# Altium schematic sheet peripherals.SchDoc
size A3
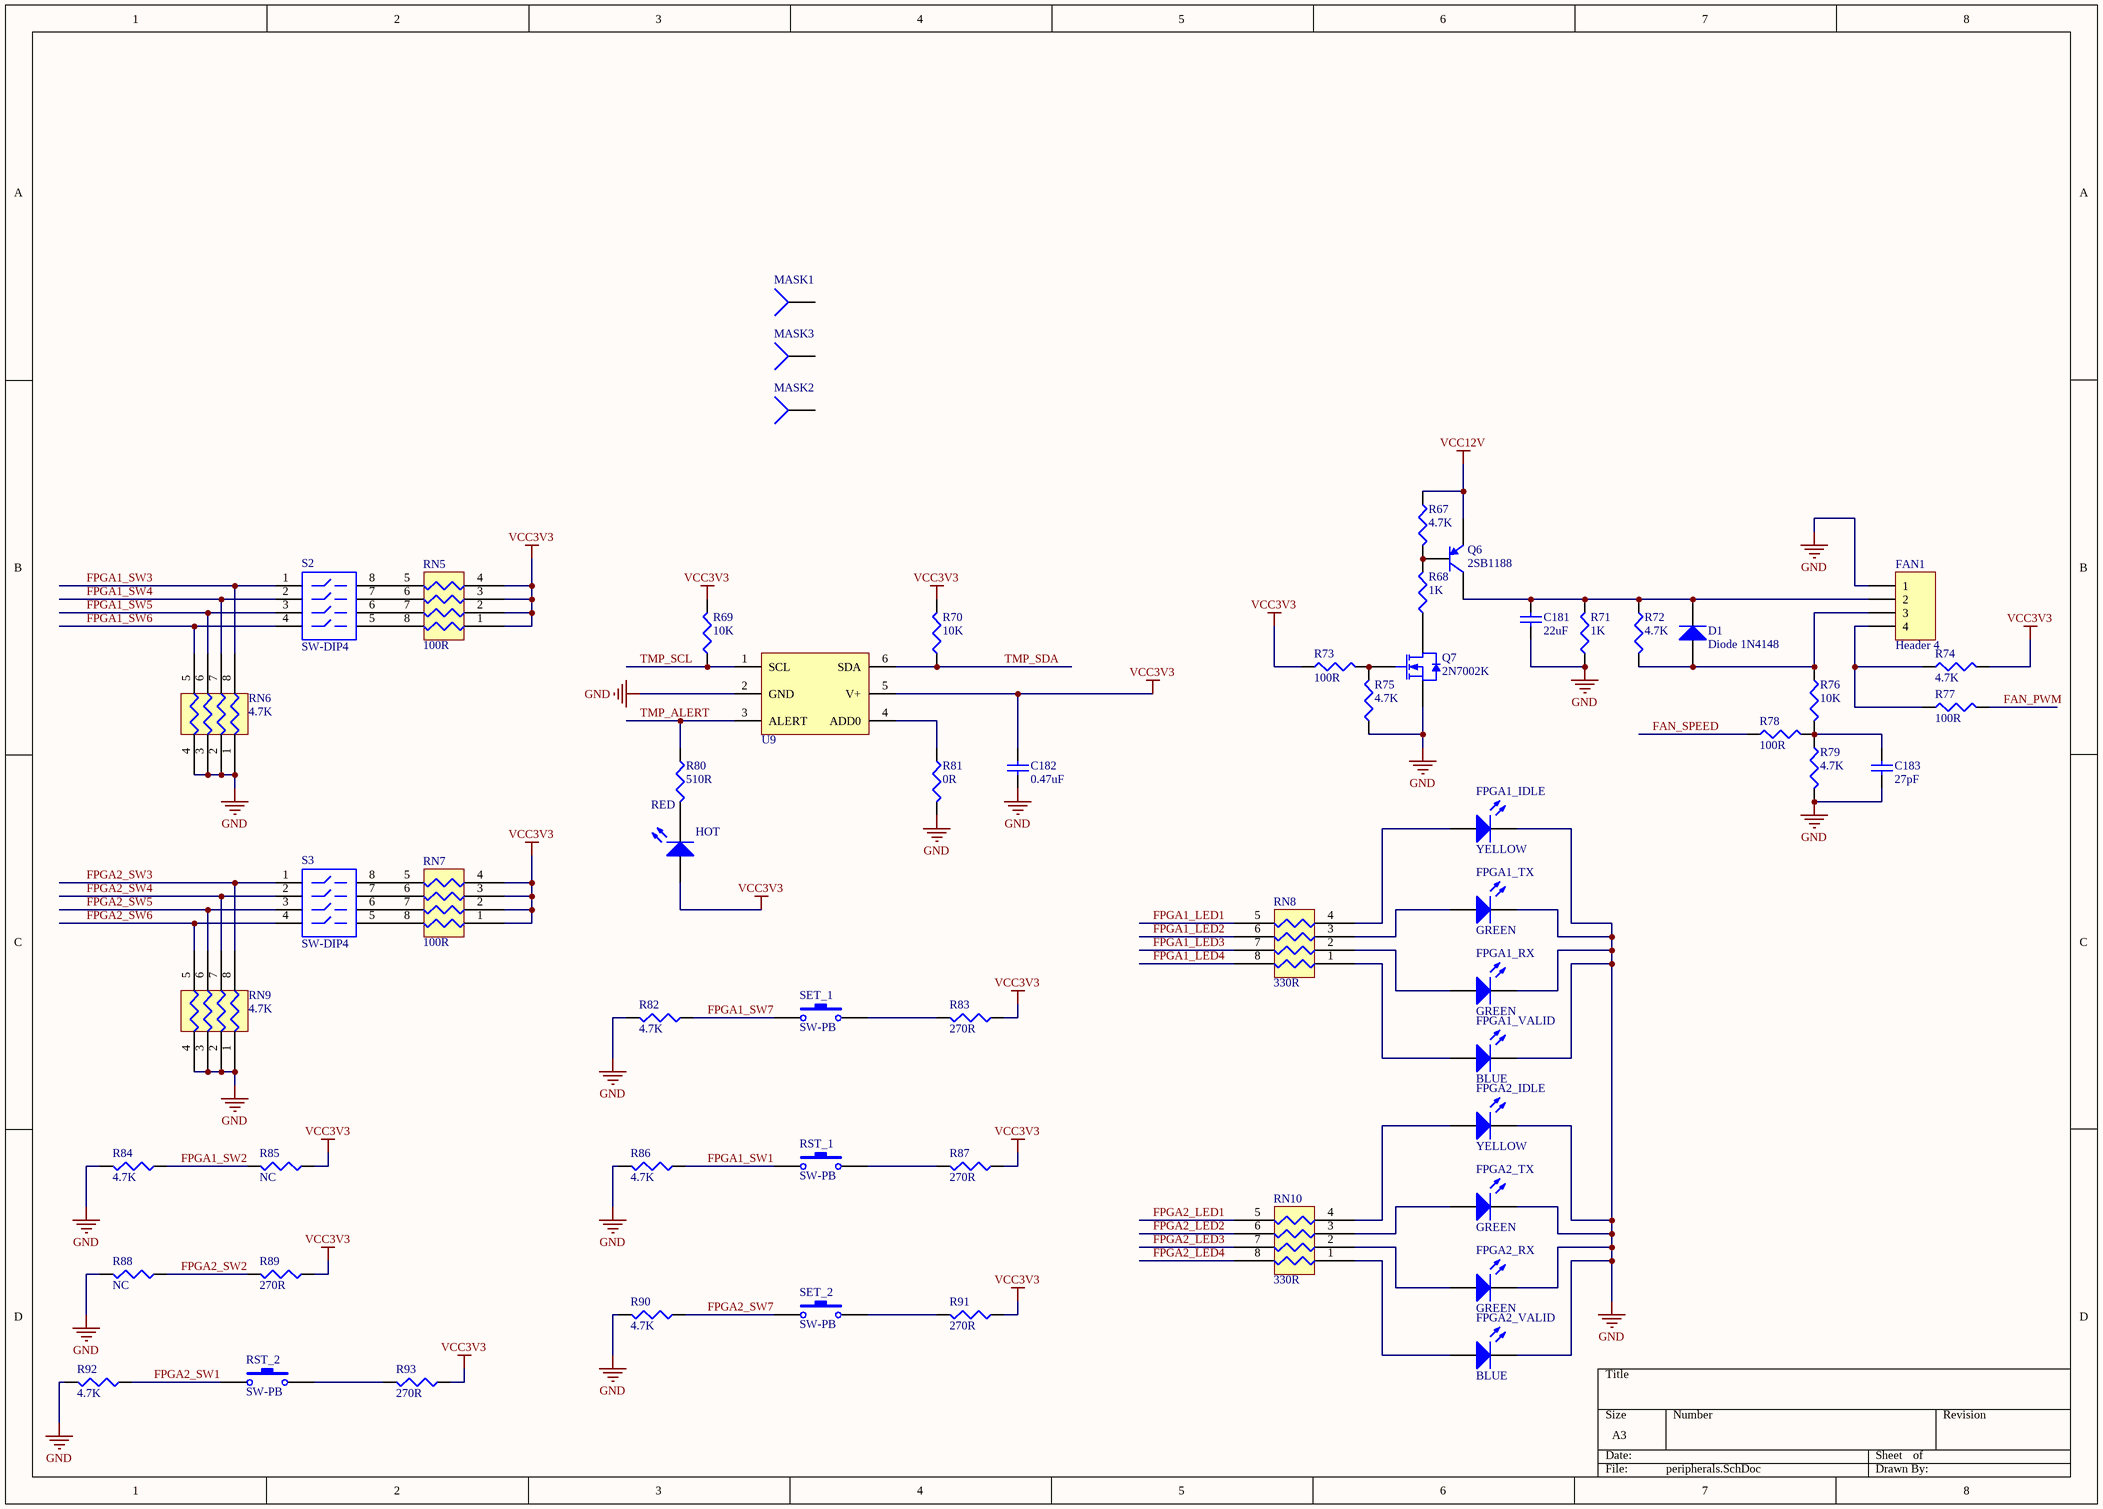
[diagram p0: peripherals.SchDoc]

## Parts
C181  22uF  [CAPC3225N]
C182  0.47uF  [CAPC1005N]
C183  27pF  [CAPC1005N]
D1  Diode 1N4148  [CD3216-1206]
FAN1  Header 4  [4PINFAN]
FPGA1_IDLE  YELLOW  [CD1608-0603]
FPGA1_RX  GREEN  [CD1608-0603]
FPGA1_TX  GREEN  [CD1608-0603]
FPGA1_VALID  BLUE  [CD1608-0603]
FPGA2_IDLE  YELLOW  [CD1608-0603]
FPGA2_RX  GREEN  [CD1608-0603]
FPGA2_TX  GREEN  [CD1608-0603]
FPGA2_VALID  BLUE  [CD1608-0603]
HOT  RED  [CD1608-0603]
MASK1  Socket  [MASK]  (value not drawn)
MASK2  Socket  [MASK]  (value not drawn)
MASK3  Socket  [MASK]  (value not drawn)
Q6  2SB1188  [SOT89M]
Q7  2N7002K  [SOT23_N]
R67  4.7K  [RESC1005N]
R68  1K  [RESC1005N]
R69  10K  [RESC1005N]
R70  10K  [RESC1005N]
R71  1K  [RESC1005N]
R72  4.7K  [RESC1005N]
R73  100R  [RESC1005N]
R74  4.7K  [RESC1005N]
R75  4.7K  [RESC1005N]
R76  10K  [RESC1005N]
R77  100R  [RESC1005N]
R78  100R  [RESC1005N]
R79  4.7K  [RESC1005N]
R80  510R  [RESC1005N]
R81  0R  [RESC1005N]
R82  4.7K  [RESC1005N]
R83  270R  [RESC1005N]
R84  4.7K  [RESC1005N]
R85  NC  [RESC1005N]
R86  4.7K  [RESC1005N]
R87  270R  [RESC1005N]
R88  NC  [RESC1005N]
R89  270R  [RESC1005N]
R90  4.7K  [RESC1005N]
R91  270R  [RESC1005N]
R92  4.7K  [RESC1005N]
R93  270R  [RESC1005N]
RN5  100R  [EXBV8V]
RN6  4.7K  [EXBV8V]
RN7  100R  [EXBV8V]
RN8  330R  [EXBV8V]
RN9  4.7K  [EXBV8V]
RN10  330R  [EXBV8V]
RST_1  SW-PB  [SKQMA]
RST_2  SW-PB  [SKQMA]
S2  SW-DIP4  [SO8W]
S3  SW-DIP4  [SO8W]
SET_1  SW-PB  [SKQMA]
SET_2  SW-PB  [SKQMA]
U9  TMP102  [SOT563]  (value not drawn)

## Nets
GND: C181.1 C182.2 C183.2 FAN1.1 FPGA1_IDLE.2(K) FPGA1_RX.2(K) FPGA1_TX.2(K) FPGA1_VALID.2(K) FPGA2_IDLE.2(K) FPGA2_RX.2(K) FPGA2_TX.2(K) FPGA2_VALID.2(K) Q7.2(S) R71.1 R75.1 R79.2 R81.2 R82.2 R84.2 R86.2 R88.2 R90.2 R92.2 RN6.1 RN6.2 RN6.3 RN6.4 RN9.1 RN9.2 RN9.3 RN9.4 U9.2(GND)
VCC3V3: C182.1 HOT.1(A) R69.2 R70.2 R73.1 R74.2 R83.1 R85.1 R87.1 R89.1 R91.1 R93.1 RN5.1 RN5.2 RN5.3 RN5.4 RN7.1 RN7.2 RN7.3 RN7.4 U9.5(V+)
VCC12V: Q6.3(E) R67.1
FAN_PWM: R77.2
FAN_SPEED: R78.1
FPGA1_LED1: RN8.5
FPGA1_LED2: RN8.6
FPGA1_LED3: RN8.7
FPGA1_LED4: RN8.8
FPGA1_SW1: R86.1 RST_1.1
FPGA1_SW2: R84.1 R85.2
FPGA1_SW3: RN6.8 S2.1
FPGA1_SW4: RN6.7 S2.2
FPGA1_SW5: RN6.6 S2.3
FPGA1_SW6: RN6.5 S2.4
FPGA1_SW7: R82.1 SET_1.1
FPGA2_LED1: RN10.5
FPGA2_LED2: RN10.6
FPGA2_LED3: RN10.7
FPGA2_LED4: RN10.8
FPGA2_SW1: R92.1 RST_2.1
FPGA2_SW2: R88.1 R89.2
FPGA2_SW3: RN9.8 S3.1
FPGA2_SW4: RN9.7 S3.2
FPGA2_SW5: RN9.6 S3.3
FPGA2_SW6: RN9.5 S3.4
FPGA2_SW7: R90.1 SET_2.1
TMP_ALERT: R80.1 U9.3(ALERT)
TMP_SCL: R69.1 U9.1(SCL)
TMP_SDA: R70.1 U9.6(SDA)
NetC181_2: C181.2 D1.2(K) FAN1.2 Q6.1(C) R71.2 R72.1
NetC183_1: C183.1 R76.2 R78.2 R79.1
NetD1_1: D1.1(A) FAN1.3 R72.2 R76.1
NetFAN1_4: FAN1.4 R74.1 R77.1
NetFPGA1_IDLE_1: FPGA1_IDLE.1(A) RN8.4
NetFPGA1_RX_1: FPGA1_RX.1(A) RN8.2
NetFPGA1_TX_1: FPGA1_TX.1(A) RN8.3
NetFPGA1_VALID_1: FPGA1_VALID.1(A) RN8.1
NetFPGA2_IDLE_1: FPGA2_IDLE.1(A) RN10.4
NetFPGA2_RX_1: FPGA2_RX.1(A) RN10.2
NetFPGA2_TX_1: FPGA2_TX.1(A) RN10.3
NetFPGA2_VALID_1: FPGA2_VALID.1(A) RN10.1
NetHOT_2: HOT.2(K) R80.2
NetQ6_2: Q6.2(B) R67.2 R68.2
NetQ7_1: Q7.1(G) R73.2 R75.2
NetQ7_3: Q7.3(D) R68.1
NetR81_1: R81.1 U9.4(ADD0)
NetR83_2: R83.2 SET_1.2
NetR87_2: R87.2 RST_1.2
NetR91_2: R91.2 SET_2.2
NetR93_2: R93.2 RST_2.2
NetRN5_5: RN5.5 S2.8
NetRN5_6: RN5.6 S2.7
NetRN5_7: RN5.7 S2.6
NetRN5_8: RN5.8 S2.5
NetRN7_5: RN7.5 S3.8
NetRN7_6: RN7.6 S3.7
NetRN7_7: RN7.7 S3.6
NetRN7_8: RN7.8 S3.5

Not connected (* = marked no-connect by the designer): MASK1 1; MASK2 1; MASK3 1

## Library data of the parts
C181-C183 = Cap Semi: Capacitor (Semiconductor SIM Model); Published: 8-Jun-2000; LatestRevisionDate: 29-May-2009; LatestRevisionNote: IPC-7351 Footprint Added.; PackageReference: C1206; Publisher: Altium Limited; PackageDescription: Chip Capacitor
  C181: Value: 22uF
  C182: Value: 0.47uF
  C183: Value: 27pF
D1 = Diode 1N4148: High Conductance Fast Diode; Published: 8-Jun-2000; LatestRevisionDate: 17-Jul-2002; LatestRevisionNote: Re-released for DXP Platform.; DatasheetVersion: 1997; PackageReference: DO-35; Publisher: Altium Limited; PackageDescription: Diode, Axial; Body 3.8 x 1.9 mm (LxDia. max), Lead Dia. 0.53 mm (max); Code_JEDEC: DO-204-AH; ComponentLink1Description: Manufacturer Link; ComponentLink1URL: http://www.fairchildsemi.com/; ComponentLink2Description: Datasheet; ComponentLink2URL: http://www.fairchildsemi.com/ds/1N%2F1N4148.pdf
FAN1 = Header 4: Header, 4-Pin; LatestRevisionDate: 17-Jul-2002; LatestRevisionNote: Re-released for DXP Platform.; Publisher: Altium Limited
FPGA1_IDLE FPGA1_RX FPGA1_TX FPGA1_VALID FPGA2_IDLE FPGA2_RX FPGA2_TX FPGA2_VALID HOT = LED3: Typical BLUE SiC LED; Published: 8-Jun-2000; LatestRevisionDate: 17-Dec-2003; LatestRevisionNote: PCB Footprint replaced.; DatasheetVersion: 16-Apr-2002; PackageVersion: 16-Apr-2002; PackageReference: 3.5X2.8X1.9; Publisher: Altium Limited; PackageDescription: SM LED; 2 C-Bend Leads; Body 3.5 x 2.8 x 1.9 mm, inc leads (LxWxH typ)
MASK1-MASK3 = Socket: pin to pad: 1>0; LatestRevisionDate: 17-Jul-2002; LatestRevisionNote: Re-released for DXP Platform.; Publisher: Altium Limited
Q6 = PNP: PNP Bipolar Transistor; pin to pad: 1>2 2>1; Published: 8-Jun-2000; LatestRevisionDate: 29-May-2009; LatestRevisionNote: IPC-7351 Footprint Added.; PackageVersion: Aug-1999; PackageReference: SOT-23B; Publisher: Altium Limited; PackageDescription: 3-Pin SOT-23 Package 0.95 mm Pitch, 2.4 mm Lead Span
Q7 = 2N7002: N-channel Enhancement Mode Field-effect Transistor; Published: 17-Sep-2003; LatestRevisionDate: 12-Dec-2006; LatestRevisionNote: IPC-7351 Footprint Added.; DatasheetVersion: 27-Jul-2000; PackageVersion: May-1999; PackageReference: SOT23; Publisher: Altium Limited; PackageDescription: 3-Pin SOT-23 Package 0.95 mm Pitch, 2.3 mm Lead Span; ComponentLink1Description: Manufacturer Link; ComponentLink1URL: http://www.semiconductors.philips.com/; ComponentLink2Description: Datasheet; ComponentLink2URL: http://www.semiconductors.philips.com/acrobat/datasheets/2N7002_4.pdf
R67-R93 = Res3: Resistor; Published: 8-Jun-2000; LatestRevisionDate: 29-May-2009; LatestRevisionNote: IPC-7351 Footprint Added.; PackageReference: J1-0603; Publisher: Altium Limited; PackageDescription: Chip Resistor
  R67 R72 R74 R75 R79 R82 R84 R86 R90 R92: Value: 4.7K
  R68 R71: Value: 1K
  R69 R70 R76: Value: 10K
  R73 R77 R78: Value: 100R
  R80: Value: 510R
  R81: Value: 0R
  R83 R87 R89 R91 R93: Value: 270R
  R85 R88: Value: NC
RN5-RN10 = RES4PACK
RST_1 RST_2 SET_1 SET_2 = SW-PB: Switch; Published: 24-Mar-1999; LatestRevisionDate: 17-Jul-2002; LatestRevisionNote: Re-released for DXP Platform.; PackageReference: SPST-2; Publisher: Altium Limited; PackageDescription: Switch; 2 Leads
S2 S3 = SW-DIP4: DIP Switch; Published: 24-Mar-1999; LatestRevisionDate: 17-Jul-2002; LatestRevisionNote: Re-released for DXP Platform.; PackageReference: DIP-8; Publisher: Altium Limited